# EAGLE design MOSFET-Power-Control-v10 (EAGLE 6.2)
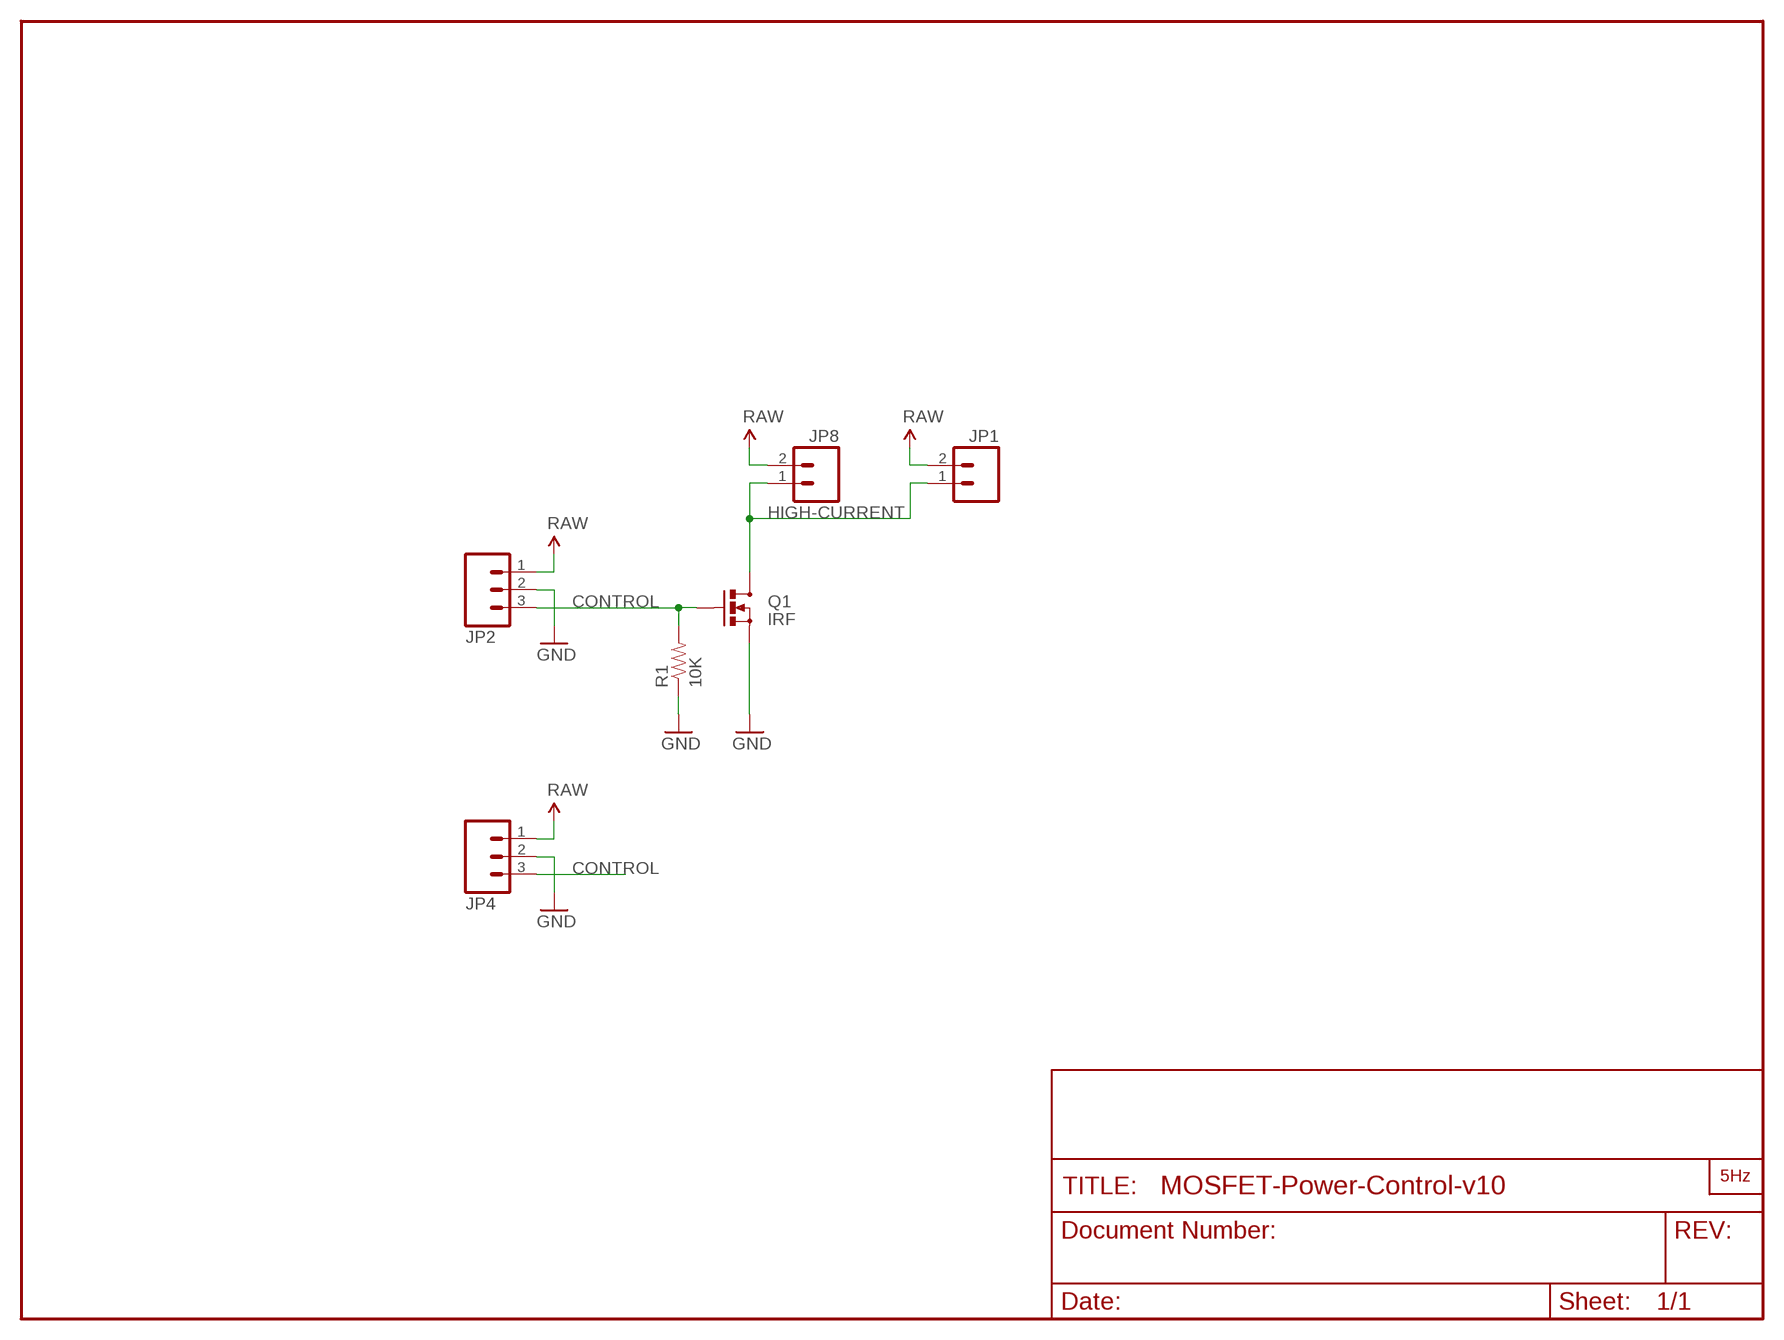
[diagram p0: schematic, sheet 1]

## Parts
JP1  M023.5MM  [SCREWTERMINAL-3.5MM-2]
JP2  M03JST-PTH  [JST-3-PTH]
JP4  M03SCREW  [SCREWTERMINAL-3.5MM-3]
JP8  M02JST-PTH-2  [JST-2-PTH]
Q1  IRF  MOSFET-NCHANNELPTH2  [TO220V]
R1  10K  RESISTORPTH1  [AXIAL-0.3]
U$1  LOGO2_SILK5MM  [LOGO2_5MM]

## Nets
CONTROL: JP2.3 JP4.3 Q1.1(G) R1.P$2
GND: JP2.2 JP4.2 Q1.3(S) R1.P$1
HIGH-CURRENT: JP1.1 JP8.1 Q1.2(D)
VCC: JP1.2 JP2.1 JP4.1 JP8.2 ; supply symbol labelled RAW

## Library data of the parts
JP1 JP8 = SparkFun:M02: Header 2 Standard 2-pin 0.1" header. Use with straight break away headers (SKU : PRT-00116), right angle break away headers (PRT-00553), swiss pins (PRT-00743), machine pins (PRT-00117), and female headers (PRT-00115). Molex polarized connector foot print use with SKU : PRT-08233 with associated crimp pins and housings.
JP2 JP4 = SparkFun:M03: Header 3 Standard 3-pin 0.1" header. Use with straight break away headers (SKU : PRT-00116), right angle break away headers (PRT-00553), swiss pins (PRT-00743), machine pins (PRT-00117), and female headers (PRT-00115). Molex polarized connector foot print use with SKU : PRT-08232 with associated crimp pins and housings.
Q1 = SparkFun:MOSFET-NCHANNEL
R1 = SparkFun:RESISTOR: Resistor Basic schematic elements and footprints for 0603, 1206, and PTH 1/10th watt (small) resistors.
U$1 = LOGO:LOGO2_SILK: PRINCIPAL

## Board
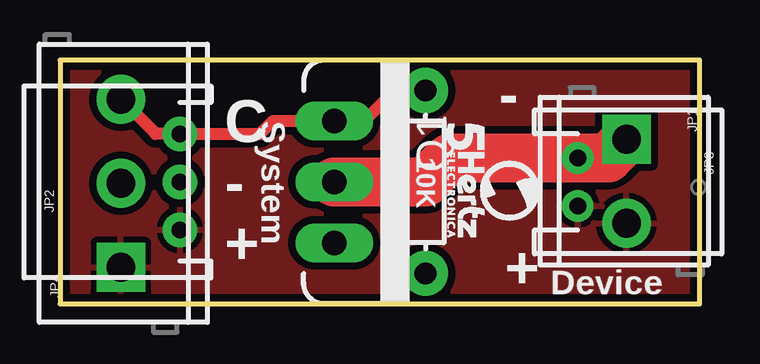
[diagram p1: board, top side]
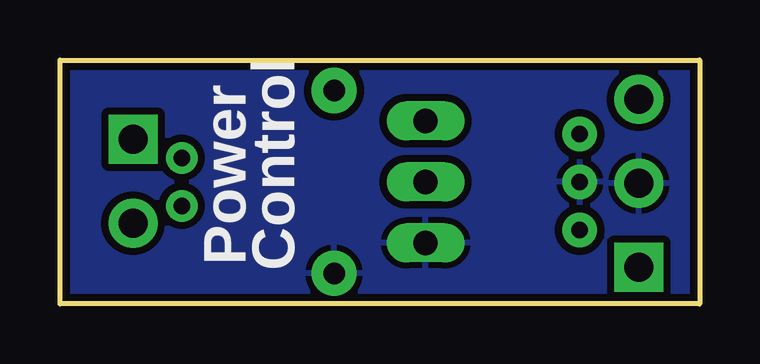
[diagram p2: board, bottom side, seen from below]

Size 26.67 x 10.16 mm. Coordinates in mm from the lower left corner, seen from the top.
Outline: 0,0 26.67,0 26.67,10.16 0,10.16 0,0
Copper layers (1*16): Top 0.035mm / dielectric 1.5mm / Bottom 0.035mm
Design rules: minimum track width 8mil, minimum drill 20mil, track to track 8mil, track to pad 8mil, pad to pad 8mil, via to via 8mil, smd to smd 8mil, copper to edge 10mil, drill to drill 8mil, minimum pad ring 12mil, minimum via ring 10mil, stop-mask expansion 4mil, vias tented up to drill 20mil, thermal gap 10mil

### Footprints (pad centres in the part's own frame; a part is rotated, then mirrored left to right if it is on the bottom)
SCREWTERMINAL-3.5MM-2 = drill 1.2 pad 2.032 square: 1 0,0 | drill 1.2 pad 2.032: 2 3.5,0
JST-3-PTH = drill 0.7 pad 1.448: 1 -2,-5; 2 0,-5; 3 2,-5
SCREWTERMINAL-3.5MM-3 = drill 1.2 pad 2.032 square: 1 0,0 | drill 1.2 pad 2.032: 2 3.5,0; 3 7,0
JST-2-PTH = drill 0.7: 1 -1,0; 2 1,0
TO220V = drill 1.016 long: 1 -2.54,0; 2 0,0; 3 2.54,0
AXIAL-0.3 = drill 0.9 pad 1.88: P$1 -3.81,0; P$2 3.81,0

### Placement (x,y rotation side)
JP1  23.62,6.86 270 top
JP2  0,5.08 90 top
JP4  2.54,1.52 90 top
JP8  21.59,5.08 270 top
Q1  11.43,5.08 270 top
R1  15.24,5.08 90 top
U$1  16.13,7.49 270 top

### Tracks (layer width: path | path; a pad name or v marks a point on that pad's centre or on a via)
CONTROL
  Top 0.508: R1.P$2 13.97,8.89 12.7,7.62 Q1.1 8.89,7.62 8.35,7.08 JP2.3 3.98,7.08 JP4.3
GND
  pour Bottom (isolate 0.305): 0,10.16 26.67,10.16 26.67,0 0,0
HIGH-CURRENT
  Top 2.032: Q1.2 15.24,5.08 16.24,6.08 JP8.1 22.84,6.08 JP1.1
VCC
  pour Top (isolate 0.305): 0,10.16 26.67,10.16 26.67,0 0,0

### Text on the board
tPlace: System | - | C | - | + | + | Device
bPlace: Control | Power